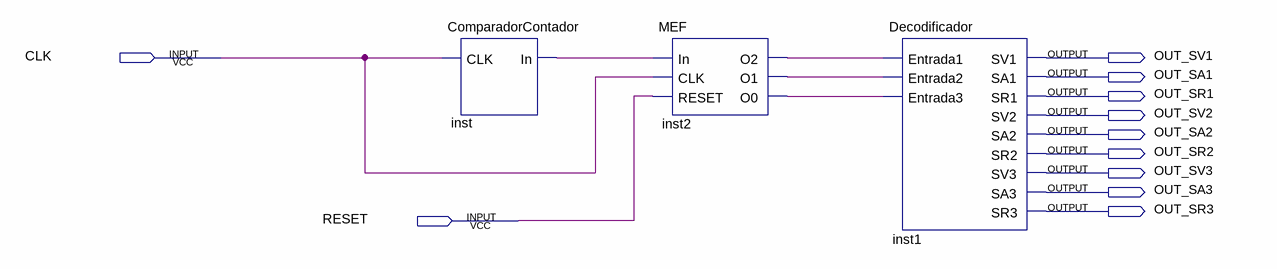
[diagram p0: schematic sheet]
// Quartus schematic CircuitoPrincipal.bdf as structural Verilog: 3 symbols, 11 pins
module CircuitoPrincipal (
  input  CLK,
  input  RESET,
  output OUT_SV1,
  output OUT_SA1,
  output OUT_SR1,
  output OUT_SV2,
  output OUT_SA2,
  output OUT_SR2,
  output OUT_SV3,
  output OUT_SA3,
  output OUT_SR3
);

  wire inst2_o0, inst2_o1, inst2_o2, inst_in;

  ComparadorContador inst (.CLK(CLK), .In(inst_in));
  MEF inst2 (.In(inst_in), .CLK(CLK), .RESET(RESET), .O2(inst2_o2), .O1(inst2_o1), .O0(inst2_o0));
  Decodificador inst1 (
    .Entrada1(inst2_o2), .Entrada2(inst2_o1), .Entrada3(inst2_o0), .SV1(OUT_SV1), .SA1(OUT_SA1),
    .SR1(OUT_SR1), .SV2(OUT_SV2), .SA2(OUT_SA2), .SR2(OUT_SR2), .SV3(OUT_SV3), .SA3(OUT_SA3), .SR3(OUT_SR3));
endmodule
